# EAGLE design BusBlaster-v2.6 (EAGLE 5.10)
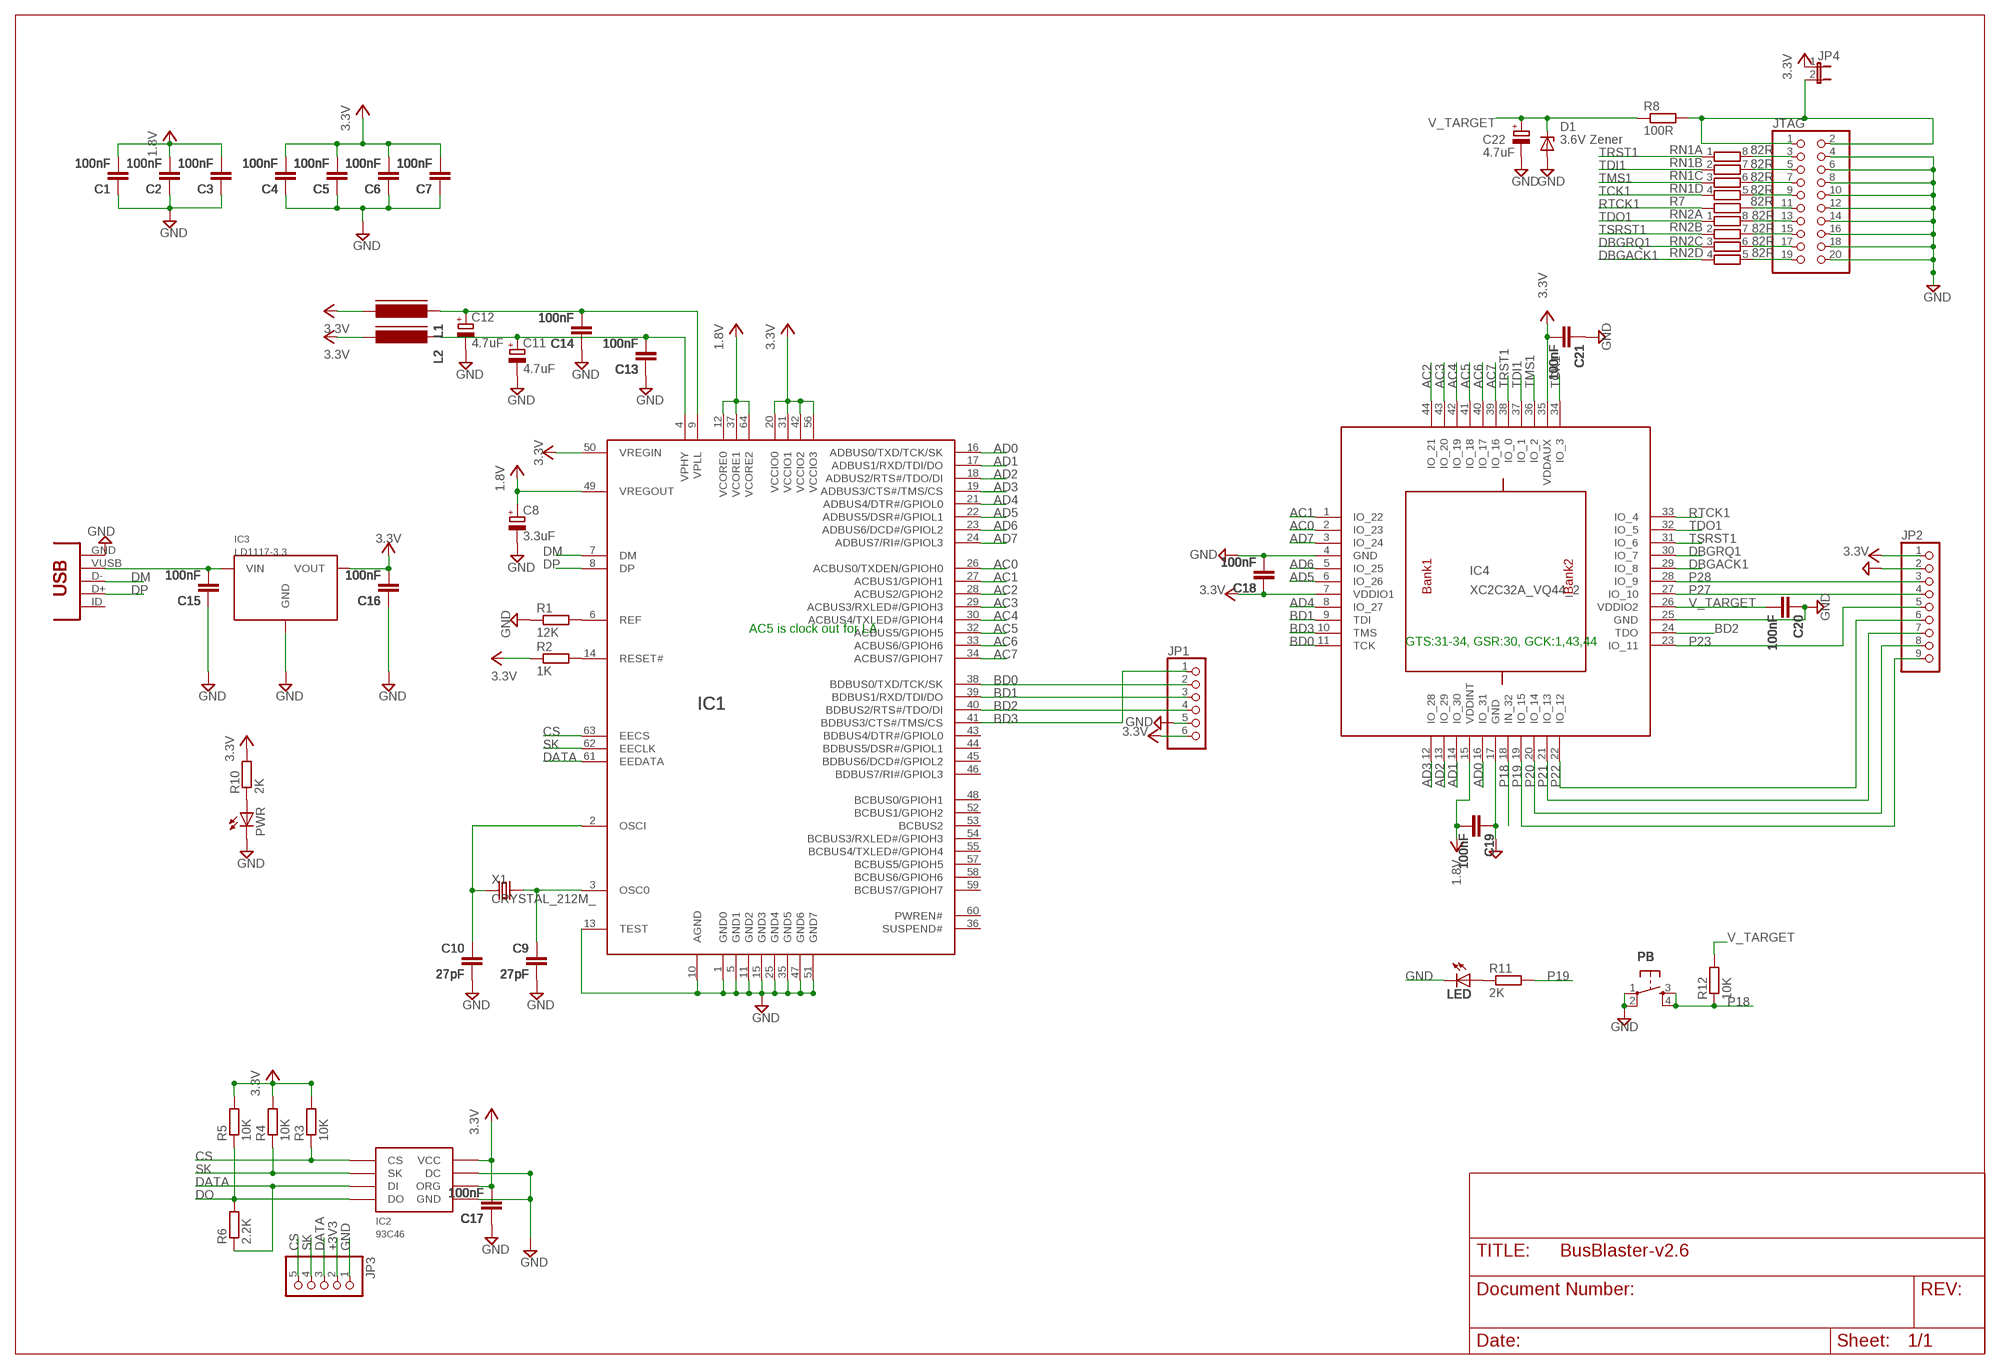
[diagram p0: schematic, sheet 1]

## Parts
C1  100nF  CAPC603  [C603]
C2  100nF  CAPC603  [C603]
C3  100nF  CAPC603  [C603]
C4  100nF  CAPC603  [C603]
C5  100nF  CAPC603  [C603]
C6  100nF  CAPC603  [C603]
C7  100nF  CAPC603  [C603]
C8  3.3uF  CAP_POLSMC_A  [SMC_A]
C9  27pF  CAPC603  [C603]
C10  27pF  CAPC603  [C603]
C11  4.7uF  CAP_POLSMC_A  [SMC_A]
C12  4.7uF  CAP_POLSMC_A  [SMC_A]
C13  100nF  CAPC603  [C603]
C14  100nF  CAPC603  [C603]
C15  100nF  CAPC603  [C603]
C16  100nF  CAPC603  [C603]
C17  100nF  CAPC603  [C603]
C18  100nF  CAPC603  [C603]
C19  100nF  CAPC603  [C603]
C20  100nF  CAPC603  [C603]
C21  100nF  CAPC603  [C603]
C22  4.7uF  CAP_POLSMC_A  [SMC_A]
D1  3.6V Zener  ZENERSOD-123  [SOD-123]
IC1  FT2232H  [LQFP64]
IC2  93C46  [SOIC8]
IC3  LD1117-3.3  [SOT223]
IC4  XC2C32A_VQ44_2  [VQ44]
JP1  PINHD-1X6  [1X06]
JP2  PINHD-1X9  [1X09]
JP3  PINHD-1X5  [1X05]
JP4  JP1EJP  [1X02]
JTAG  PINHEAD_-_COPY_PINHD-2X10SHROUDED  [PINHEAD_-_COPY_PINSHRD_PTH_2X10]
L1  FERRITE_BEAD603  [FB603]
L2  FERRITE_BEAD603  [FB603]
LED  LED805  [LED-805]
PB  SW-SMD-SMALL  [TACT_SWITCH_SMALL]
PWR  LEDCHIPLED_0805  [CHIPLED_0805]
R1  12K  RESISTORR603  [R603]
R2  1K  RESISTORR603  [R603]
R3  10K  RESISTORR603  [R603]
R4  10K  RESISTORR603  [R603]
R5  10K  RESISTORR603  [R603]
R6  2.2K  RESISTORR603  [R603]
R7  82R  RESISTORR603  [R603]
R8  100R  RESISTORR1206  [R1206]
R10  2K  RESISTORR603  [R603]
R11  2K  RESISTORR603  [R603]
R12  10K  RESISTORR603  [R603]
RN1  82R  RNETWORK  [RN8P-4R-CRA06S]
RN2  82R  RNETWORK  [RN8P-4R-CRA06S]
USB  CON-USB-MINI-BUSB1  [CONN_USB_MINI-B]
X1  CRYSTAL_212M_  [4X6]

## Nets
1.8V: C1.2 C2.2 C3.2 C8.+ C19.2 IC1.12(VCORE0) IC1.37(VCORE1) IC1.49(VREGOUT) IC1.64(VCORE2) IC4.15(VDDINT)
+3V3: C4.2 C5.2 C6.2 C7.2 C16.2 C17.2 C18.1 C21.2 IC1.20(VCCIO0) IC1.31(VCCIO1) IC1.42(VCCIO2) IC1.50(VREGIN) IC1.56(VCCIO3) IC2.6(ORG) IC2.8(VCC) IC3.2(VOUT) IC4.7(VDDIO1) IC4.35(VDDAUX) JP1.6 JP2.1 JP3.2 JP4.1 L1.2 L2.2 R2.1 R3.2 R4.2 R5.2 R10.2 ; supply symbol labelled 3.3V
AC0: IC1.26(ACBUS0/TXDEN/GPIOH0) IC4.2(IO_23)
AC1: IC1.27(ACBUS1/GPIOH1) IC4.1(IO_22)
AC2: IC1.28(ACBUS2/GPIOH2) IC4.44(IO_21)
AC3: IC1.29(ACBUS3/RXLED#/GPIOH3) IC4.43(IO_20)
AC4: IC1.30(ACBUS4/TXLED#/GPIOH4) IC4.42(IO_19)
AC5: IC1.32(ACBUS5/GPIOH5) IC4.41(IO_18)
AC6: IC1.33(ACBUS6/GPIOH6) IC4.40(IO_17)
AC7: IC1.34(ACBUS7/GPIOH7) IC4.39(IO_16)
AD0: IC1.16(ADBUS0/TXD/TCK/SK) IC4.16(IO_31)
AD1: IC1.17(ADBUS1/RXD/TDI/DO) IC4.14(IO_30)
AD2: IC1.18(ADBUS2/RTS#/TDO/DI) IC4.13(IO_29)
AD3: IC1.19(ADBUS3/CTS#/TMS/CS) IC4.12(IO_28)
AD4: IC1.21(ADBUS4/DTR#/GPIOL0) IC4.8(IO_27)
AD5: IC1.22(ADBUS5/DSR#/GPIOL1) IC4.6(IO_26)
AD6: IC1.23(ADBUS6/DCD#/GPIOL2) IC4.5(IO_25)
AD7: IC1.24(ADBUS7/RI#/GPIOL3) IC4.3(IO_24)
BD0: IC1.38(BDBUS0/TXD/TCK/SK) IC4.11(TCK) JP1.2
BD1: IC1.39(BDBUS1/RXD/TDI/DO) IC4.9(TDI) JP1.3
BD2: IC1.40(BDBUS2/RTS#/TDO/DI) IC4.24(TDO) JP1.4
BD3: IC1.41(BDBUS3/CTS#/TMS/CS) IC4.10(TMS) JP1.1
CS: IC1.63(EECS) IC2.1(CS) JP3.5 R3.1
DATA: IC1.61(EEDATA) IC2.3(DI) JP3.3 R6.1
DBGACK1: IC4.29(IO_8) RN2.4
DBGRQ1: IC4.30(IO_7) RN2.3
DM: IC1.7(DM) USB.D-
DO: IC2.4(DO) R5.1 R6.2
DP: IC1.8(DP) USB.D+
GND: C1.1 C2.1 C3.1 C4.1 C5.1 C6.1 C7.1 C8.- C9.2 C10.2 C11.- C12.- C13.1 C14.1 C15.1 C16.1 C17.1 C18.2 C19.1 C20.1 C21.1 C22.- D1.A IC1.1(GND0) IC1.5(GND1) IC1.10(AGND) IC1.11(GND2) IC1.13(TEST) IC1.15(GND3) IC1.25(GND4) IC1.35(GND5) IC1.47(GND6) IC1.51(GND7) IC2.5(GND) IC2.7(DC) IC3.1(GND) IC4.4(GND) IC4.17(GND) IC4.25(GND) JP1.5 JP2.2 JP3.1 JTAG.4 JTAG.6 JTAG.8 JTAG.10 JTAG.12 JTAG.14 JTAG.16 JTAG.18 JTAG.20 LED.C PB.1 PB.2 PWR.C R1.1 USB.GND
N$1: C9.1 IC1.3(OSC0) X1.2(X2)
N$2: C10.1 IC1.2(OSCI) X1.1(X1)
N$3: IC1.14(RESET#) R2.2
N$4: IC1.6(REF) R1.2
N$5: C15.2 IC3.3(VIN) USB.VUSB
N$6: PWR.A R10.1
N$7: JTAG.3 RN1.8
N$8: LED.A R11.1
N$9: JTAG.5 RN1.7
N$10: JTAG.7 RN1.6
N$11: JTAG.9 RN1.5
N$12: JTAG.11 R7.2
N$13: JTAG.13 RN2.8
N$14: JTAG.15 RN2.7
N$15: JTAG.17 RN2.6
N$16: JTAG.19 RN2.5
P18: IC4.18(IN_32) PB.3 PB.4 R12.1
P19: IC4.19(IO_15) JP2.9 R11.2
P20: IC4.20(IO_14) JP2.8
P21: IC4.21(IO_13) JP2.7
P22: IC4.22(IO_12) JP2.6
P23: IC4.23(IO_11) JP2.5
P27: IC4.27(IO_10) JP2.4
P28: IC4.28(IO_9) JP2.3
RTCK1: IC4.33(IO_4) R7.1
SK: IC1.62(EECLK) IC2.2(SK) JP3.4 R4.1
TCK1: IC4.34(IO_3) RN1.4
TDI1: IC4.37(IO_1) RN1.2
TDO1: IC4.32(IO_5) RN2.1
TMS1: IC4.36(IO_2) RN1.3
TRST1: IC4.38(IO_0) RN1.1
TSRST1: IC4.31(IO_6) RN2.2
V_TARGET: C20.2 C22.+ D1.C IC4.26(VDDIO2) R8.1 R12.2
V_TARGET_UNREG: JP4.2 JTAG.1 JTAG.2 R8.2
VPHY: C11.+ C13.2 IC1.4(VPHY) L2.1
VPLL: C12.+ C14.2 IC1.9(VPLL) L1.1
Unconnected: IC1.36(SUSPEND#) IC1.43(BDBUS4/DTR#/GPIOL0) IC1.44(BDBUS5/DSR#/GPIOL1) IC1.45(BDBUS6/DCD#/GPIOL2) IC1.46(BDBUS7/RI#/GPIOL3) IC1.48(BCBUS0/GPIOH1) IC1.52(BCBUS1/GPIOH2) IC1.53(BCBUS2) IC1.54(BCBUS3/RXLED#/GPIOH3) IC1.55(BCBUS4/TXLED#/GPIOH4) IC1.57(BCBUS5/GPIOH5) IC1.58(BCBUS6/GPIOH6) IC1.59(BCBUS7/GPIOH7) IC1.60(PWREN#) USB.BODY@1(BODY) USB.BODY@2(BODY) USB.BODY@3(BODY) USB.BODY@4(BODY) USB.ID(USBID)

## Notes on the sheet
- AC5 is clock out for LA
- GTS:31-34, GSR:30, GCK:1,43,44

## Library data of the parts
C1-C7 C9 C10 C13-C21 = dp_devices:CAP
C8 C11 C12 C22 = DP-EagleLibrary:CAP_POL
D1 = dp_devices:ZENER: Zener Diode SOD-323
IC1 = dp_devices:FT2232H: DUAL HIGH SPEED USB TO MULTIPURPOSE UART/FIFO IC
IC2 = DP-EagleLibrary:93C46
IC3 = DP-EagleLibrary:LD1117-3.3
IC4 = dp_devices:XC2C32A_VQ44_2: xc2c32a_vq44-ian edit this description Auto generated by make-symbol-device-package-bsdl.ulp Rev. 29 Source: xc2c32a_vq44-ian.bsd
JP1 = pinhead:PINHD-1X6: PIN HEADER
JP2 = pinhead - Copy:PINHD-1X9: PIN HEADER
JP3 = pinhead:PINHD-1X5: PIN HEADER
JP4 = jumper:JP1E: JUMPER
JTAG = LPC1768board:PINHEAD_-_COPY_PINHD-2X10: PIN HEADER
L1 L2 = dp_devices:FERRITE_BEAD
LED = dp_devices:LED
PB = dp_devices:SW-SMD-SMALL
PWR = led:LED: LED OSRAM: - CHIPLED LG R971, LG N971, LY N971, LG Q971, LY Q971, LO R971, LY R971 LH N974, LH R974 LS Q976, LO Q976, LY Q976 LO Q996 - Hyper CHIPLED LW Q18S LB Q993, LB Q99A, LB R99A - SideLED LS A670, LO A670, LY A670, LG A670, LP A670 LB A673, LV A673, LT A673, LW A673 LH A674 LY A675 LS A676, LA A676, LO A676, LY A676, LW A676 LS A679, LY A679, LG A679 - Hyper Micro SIDELED® LS Y876, LA Y876, LO Y876, LY Y876 LT Y87S - SmartLED LW L88C, LW L88S LB L89C, LB L89S, LG L890 LS L89K, LO L89K, LY L89K LS L896, LA L896, LO L896, LY L896 - TOPLED LS T670, LO T670, LY T670, LG T670, LP T670 LSG T670, LSP T670, LSY T670, LOP T670, LYG T670 LG T671, LOG T671, LSG T671 LB T673, LV T673, LT T673, LW T673 LH T674 LS T676, LA T676, LO T676, LY T676, LB T676, LH T676, LSB T676, LW T676 LB T67C, LV T67C, LT T67C, LS T67K, LO T67K, LY T67K, LW E67C LS E67B, LA E67B, LO E67B, LY E67B, LB E67C, LV E67C, LT E67C LW T67C LS T679, LY T679, LG T679 LS T770, LO T770, LY T770, LG T770, LP T770 LB T773, LV T773, LT T773, LW T773 LH T774 LS E675, LA E675, LY E675, LS T675 LS T776, LA T776, LO T776, LY T776, LB T776 LHGB T686 LT T68C, LB T68C - Hyper Mini TOPLED® LB M676 - Mini TOPLED Santana® LG M470 LS M47K, LO M47K, LY M47K Source: http://www.osram.convergy.de LUXEON: - LUMILED® LXK2-PW12-R00, LXK2-PW12-S00, LXK2-PW14-U00, LXK2-PW14-V00 LXK2-PM12-R00, LXK2-PM12-S00, LXK2-PM14-U00 LXK2-PE12-Q00, LXK2-PE12-R00, LXK2-PE12-S00, LXK2-PE14-T00, LXK2-PE14-U00 LXK2-PB12-K00, LXK2-PB12-L00, LXK2-PB12-M00, LXK2-PB14-N00, LXK2-PB14-P00, LXK2-PB14-Q00 LXK2-PR12-L00, LXK2-PR12-M00, LXK2-PR14-Q00, LXK2-PR14-R00 LXK2-PD12-Q00, LXK2-PD12-R00, LXK2-PD12-S00 LXK2-PH12-R00, LXK2-PH12-S00 LXK2-PL12-P00, LXK2-PL12-Q00, LXK2-PL12-R00 Source: www.luxeon.com KINGBRIGHT: KA-3528ASYC Source: www.kingbright.com
R1-R8 R10-R12 = dp_devices:RESISTOR
RN1 RN2 = dp_devices:RNETWORK: 4 Resistor Array 0603
USB = dp_devices:CON-USB-MINI-B: USB connector
X1 = dp_devices:CRYSTAL_2

## Board
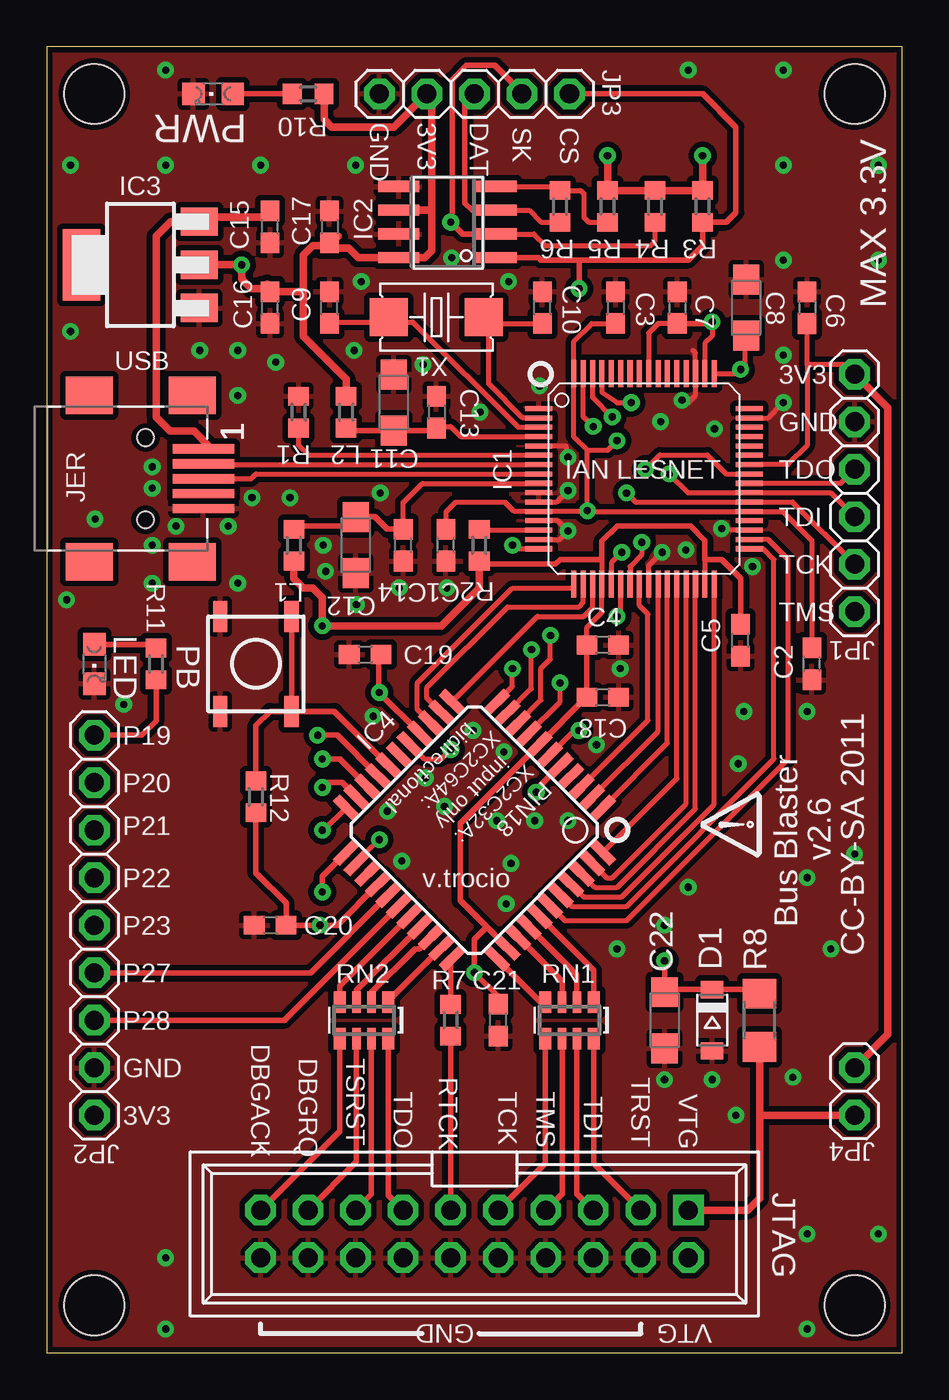
[diagram p1: board, top side]
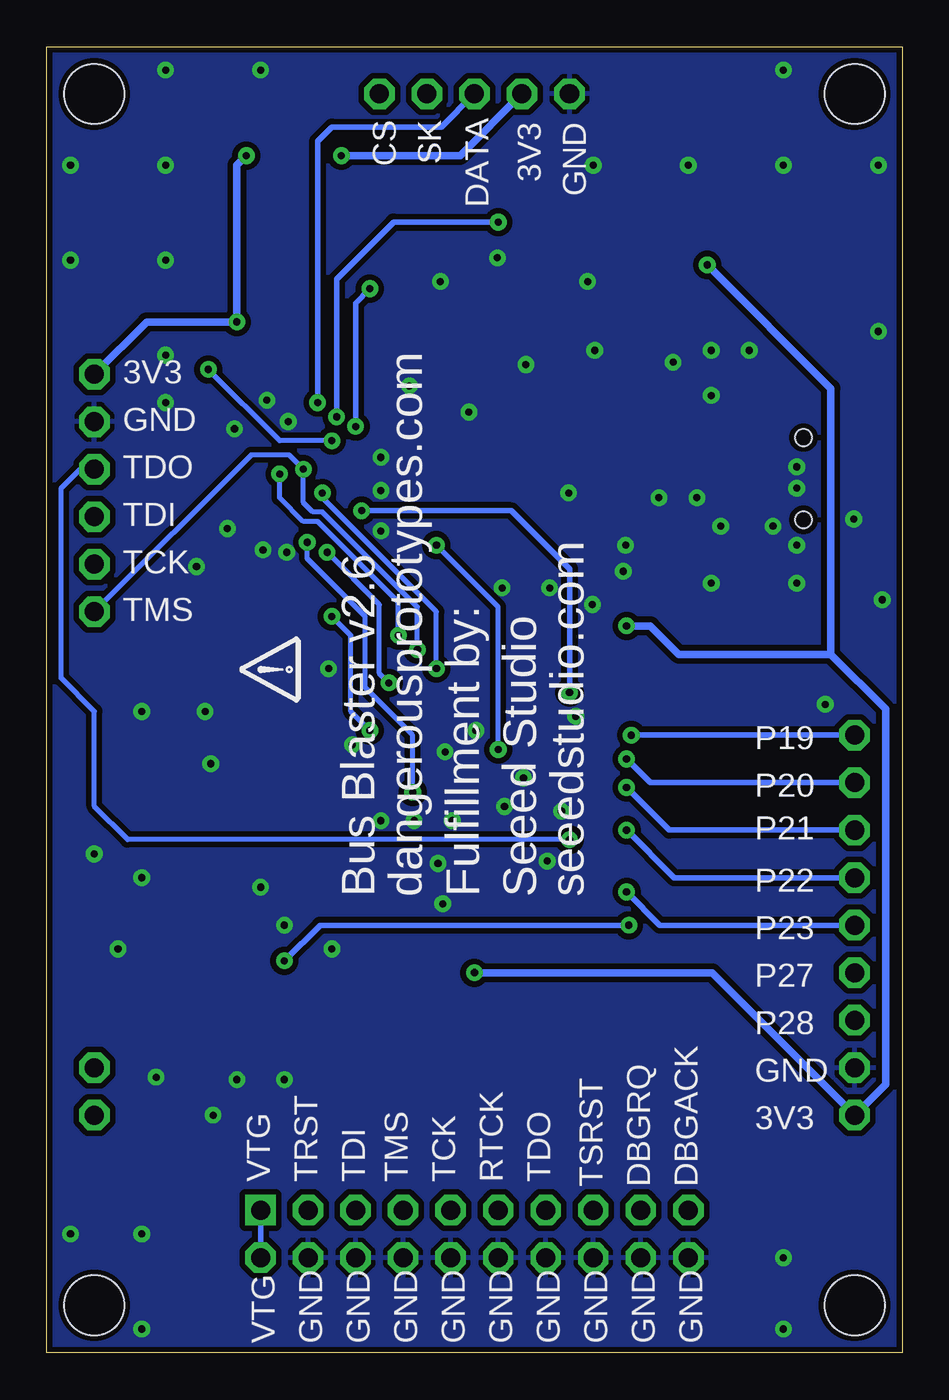
[diagram p2: board, bottom side, seen from below]

Size 45.72 x 69.83 mm. Coordinates in mm from the lower left corner, seen from the top.
Outline: 0,0 45.72,0 45.72,69.83 0,69.83 0,0
Copper layers (1*16): Top 0.035mm / dielectric 1.5mm / Bottom 0.035mm
Design rules "SparkFun": minimum track width 8mil, minimum drill 20mil, track to track 8mil, track to pad 8mil, pad to pad 8mil, via to via 8mil, smd to smd 8mil, copper to edge 10mil, drill to drill 8mil, minimum pad ring 12mil, minimum via ring 10mil, stop-mask expansion 4mil, vias tented up to drill 25mil, thermal gap 10mil
Holes 3.2 mm at 2.54,2.54 2.54,67.31 43.18,67.31 43.18,2.54

### Footprints (pad centres in the part's own frame; a part is rotated, then mirrored left to right if it is on the bottom)
C603 = smd 1.1 x 1: 1 -0.85,0; 2 0.85,0
SMC_A = smd 1.6 x 1.4: + -1.5,0; - 1.5,0
SOD-123 = smd 0.91 x 1.22: A 1.635,0; C -1.635,0
LQFP64 = smd 1.45 x 0.27: 1 -5.625,3.75; 2 -5.625,3.25; 3 -5.625,2.75; 4 -5.625,2.25; 5 -5.625,1.75; 6 -5.625,1.25; 7 -5.625,0.75; 8 -5.625,0.25; 9 -5.625,-0.25; 10 -5.625,-0.75; 11 -5.625,-1.25; 12 -5.625,-1.75; 13 -5.625,-2.25; 14 -5.625,-2.75; 15 -5.625,-3.25; 16 -5.625,-3.75; 33 5.625,-3.75; 34 5.625,-3.25; 35 5.625,-2.75; 36 5.625,-2.25; 37 5.625,-1.75; 38 5.625,-1.25; 39 5.625,-0.75; 40 5.625,-0.25; 41 5.625,0.25; 42 5.625,0.75; 43 5.625,1.25; 44 5.625,1.75; 45 5.625,2.25; 46 5.625,2.75; 47 5.625,3.25; 48 5.625,3.75 | smd 0.27 x 1.45: 17 -3.75,-5.625; 18 -3.25,-5.625; 19 -2.75,-5.625; 20 -2.25,-5.625; 21 -1.75,-5.625; 22 -1.25,-5.625; 23 -0.75,-5.625; 24 -0.25,-5.625; 25 0.25,-5.625; 26 0.75,-5.625; 27 1.25,-5.625; 28 1.75,-5.625; 29 2.25,-5.625; 30 2.75,-5.625; 31 3.25,-5.625; 32 3.75,-5.625; 49 3.75,5.625; 50 3.25,5.625; 51 2.75,5.625; 52 2.25,5.625; 53 1.75,5.625; 54 1.25,5.625; 55 0.75,5.625; 56 0.25,5.625; 57 -0.25,5.625; 58 -0.75,5.625; 59 -1.25,5.625; 60 -1.75,5.625; 61 -2.25,5.625; 62 -2.75,5.625; 63 -3.25,5.625; 64 -3.75,5.625
SOIC8 = smd 0.6 x 2.2: 1 -1.905,-2.6; 2 -0.635,-2.6; 3 0.635,-2.6; 4 1.905,-2.6; 5 1.905,2.6; 6 0.635,2.6; 7 -0.635,2.6; 8 -1.905,2.6
SOT223 = smd 1.5 x 2: 1 -2.3,-3.15; 2 0,-3.15; 3 2.3,-3.15 | smd 3.8 x 2: 4 0,3.15
VQ44 = smd 1.5 x 0.5: 1 -5.7,4; 2 -5.7,3.2; 3 -5.7,2.4; 4 -5.7,1.6; 5 -5.7,0.8; 6 -5.7,0; 7 -5.7,-0.8; 8 -5.7,-1.6; 9 -5.7,-2.4; 10 -5.7,-3.2; 11 -5.7,-4; 23 5.7,-4; 24 5.7,-3.2; 25 5.7,-2.4; 26 5.7,-1.6; 27 5.7,-0.8; 28 5.7,0; 29 5.7,0.8; 30 5.7,1.6; 31 5.7,2.4; 32 5.7,3.2; 33 5.7,4 | smd 0.5 x 1.5: 12 -4,-5.7; 13 -3.2,-5.7; 14 -2.4,-5.7; 15 -1.6,-5.7; 16 -0.8,-5.7; 17 0,-5.7; 18 0.8,-5.7; 19 1.6,-5.7; 20 2.4,-5.7; 21 3.2,-5.7; 22 4,-5.7; 34 4,5.7; 35 3.2,5.7; 36 2.4,5.7; 37 1.6,5.7; 38 0.8,5.7; 39 0,5.7; 40 -0.8,5.7; 41 -1.6,5.7; 42 -2.4,5.7; 43 -3.2,5.7; 44 -4,5.7
1X06 = drill 1.016 octagon: 1 -6.35,0; 2 -3.81,0; 3 -1.27,0; 4 1.27,0; 5 3.81,0; 6 6.35,0
1X09 = drill 1.016 octagon: 1 -10.16,0; 2 -7.62,0; 3 -5.08,0; 4 -2.54,0; 5 0,0; 6 2.54,0; 7 5.08,0; 8 7.62,0; 9 10.16,0
1X05 = drill 1.016 octagon: 1 -5.08,0; 2 -2.54,0; 3 0,0; 4 2.54,0; 5 5.08,0
1X02 = drill 1.016 octagon: 1 -1.27,0; 2 1.27,0
PINHEAD_-_COPY_PINSHRD_PTH_2X10 = drill 1.016 square: 1 -11.43,-1.27 | drill 1.016 octagon: 2 -11.43,1.27; 3 -8.89,-1.27; 4 -8.89,1.27; 5 -6.35,-1.27; 6 -6.35,1.27; 7 -3.81,-1.27; 8 -3.81,1.27; 9 -1.27,-1.27; 10 -1.27,1.27; 11 1.27,-1.27; 12 1.27,1.27; 13 3.81,-1.27; 14 3.81,1.27; 15 6.35,-1.27; 16 6.35,1.27; 17 8.89,-1.27; 18 8.89,1.27; 19 11.43,-1.27; 20 11.43,1.27
FB603 = smd 1 x 1.1: 1 -0.85,0; 2 0.85,0
LED-805 = smd 1.2 x 1.2: A 0,-1.05; C 0,1.05
TACT_SWITCH_SMALL = smd 1.651 x 0.762: 1 -2.54,1.905; 2 2.54,1.905; 3 -2.54,-1.905; 4 2.54,-1.905
CHIPLED_0805 = smd 1.2 x 1.2: A 0,-1.05; C 0,1.05
R603 = smd 1 x 1.1: 1 -0.85,0; 2 0.85,0
R1206 = smd 1.6 x 1.803: 1 -1.422,0; 2 1.422,0
RN8P-4R-CRA06S = smd 0.63 x 1.15: 1 -1.295,-0.975; 4 1.295,-0.975; 5 1.295,0.975; 8 -1.295,0.975 | smd 0.44 x 1.15: 2 -0.4,-0.975; 3 0.4,-0.975; 6 0.4,0.975; 7 -0.4,0.975
CONN_USB_MINI-B = smd 2 x 2.5: BODY@1 -4.45,2.5; BODY@2 4.45,2.5; BODY@3 4.45,-3; BODY@4 -4.45,-3 | smd 0.5 x 3.3: D+ 0,3.1; D- -0.8,3.1; GND 1.6,3.1; ID 0.8,3.1; VUSB -1.6,3.1 | hole 0.9: -2.2,0; 2.2,0
4X6@1 = smd 2.032 x 2.032: 1 -2.54,0; 2 2.54,0

### Placement (x,y rotation side)
C1  21.34,43.18 90 top
C2  40.89,36.83 90 top
C3  30.4,55.88 270 top
C4  29.72,37.84 180 top
C5  37.08,38.1 90 top
C6  40.64,55.88 270 top
C7  33.7,55.88 270 top
C8  37.38,55.88 90 top
C9  15.11,55.88 90 top
C10  26.5,55.88 90 top
C11  18.54,50.8 90 top
C12  16.51,43.18 270 top
C13  20.83,50.29 270 top
C14  19.05,43.18 90 top
C15  11.94,60.2 90 top
C16  11.94,55.88 90 top
C17  15.11,60.2 270 top
C18  29.72,35.05 0 top
C19  17.02,37.34 0 top
C20  11.94,22.86 0 top
C21  24.13,17.78 90 top
C22  33.02,17.78 270 top
D1  35.56,17.78 270 top
IC1  31.92,46.74 0 top
IC2  21.42,60.45 90 top
IC3  5,58.17 90 top
IC4  22.86,27.94 225 top
JP1  43.18,45.97 90 top
JP2  2.54,22.86 90 top
JP3  22.86,67.31 0 top
JP4  43.18,13.97 270 top
JTAG  22.86,6.35 180 top
L1  13.21,43.18 270 top
L2  16,50.29 90 top
LED  2.54,36.83 180 top
PB  11.18,36.83 90 top
PWR  8.89,67.31 90 top
R1  13.46,50.29 270 top
R2  23.11,43.18 90 top
R3  35.05,61.29 90 top
R4  32.51,61.29 90 top
R5  29.97,61.29 90 top
R6  27.43,61.29 90 top
R7  21.59,17.78 270 top
R8  38.1,17.78 270 top
R10  13.97,67.31 0 top
R11  5.84,36.83 270 top
R12  11.18,29.72 270 top
RN1  27.94,17.78 180 top
RN2  16.95,17.78 180 top
U$1  [DP_LOGO]  37.59,28.24 90 top
U$3  [DP_LOGO]  32.77,36.53 90 bottom
USB  5.27,46.74 270 top
X1  CRYSTAL_212M_  [4X6@1]  20.83,55.37 180 top

### Tracks (layer width: path | path; a pad name or v marks a point on that pad's centre or on a via)
1.8V  (via drill 0.38)
  Top 0.254: 28.88,48.26 28.17,48.96 IC1.64 28.17,54.08 29.12,55.03 C3.2 | 28.88,44.99 28.88,48.26 | C8.+ 37.34,54.33 37.34,52.83 v37.08,52.58 36.84,52.34 35.7,52.34 IC1.49 | C1.2 21.34,44.96 21.84,45.47 24.51,45.47 24.99,44.99 IC1.12 28.93,44.99 | C2.2 40.89,43.43 39.34,44.99 IC1.37 28.93,44.99 | v28.89,45.02 28.93,44.99 | 28.88,48.26 29.97,48.26 v30.48,48.77
  Top 0.305: C19.2 17.76,37.08 17.76,35.31 | 17.76,35.31 IC4.15 | 17.76,35.31 v17.78,35.31 | 28.88,44.99 28.88,45.01 v28.89,45.02
  Bottom 0.254: v37.08,52.58 33.27,48.77 v30.48,48.77
  Bottom 0.305: v17.78,35.31 17.78,41.91 20.89,45.02 v28.89,45.02
+3V3  (via drill 0.38)
  Top 0.254: C7.2 32.68,55.03 32.17,54.53 IC1.56 | C4.2 28.87,38.77 29.67,39.58 IC1.20 29.67,42.42 | R2.1 23.02,42.42 | v35.56,55.12 35.56,54.36 35.17,53.97 IC1.50 | IC1.42 39.61,47.49 40.64,48.51 40.64,52.83 | 35.17,42.42 IC1.31 | 40.64,52.83 C6.2 | JP1.6 42.67,52.83 40.64,52.83
  Top 0.305: C4.2 C18.1 28.84,35.05 IC4.7 22.1,28.31 22.1,24.18 23.52,22.76 | C5.2 37.08,41.41 36.07,42.42 35.17,42.42 35.17,43.44 34.42,44.2 30.48,44.2 29.67,43.39 29.67,42.42 27.43,42.42 27.18,42.16 22.86,42.16 | 23.52,22.76 IC4.35 | C7.2 35.47,55.03 v35.56,55.12 | 23.52,22.76 22.86,22.1 v22.86,20.32 24.13,19.05 C21.2 | 23.11,42.42 22.86,42.16 | 23.11,42.42 23.11,42.67 | 23.02,42.42 23.02,42.07 | 23.02,42.07 22.86,42.16 | 23.11,42.42 R2.1 23.11,42.16 23.02,42.07
  Top 0.406: C17.2 15.58,59.69 | C17.2 14.95,59.05 16.13,59.05 16.64,58.55 IC2.8 20.19,58.55 20.57,58.93 20.57,61.09 | 8.66,58.14 IC3.2 v10.41,58.17 10.41,57.4 10.92,56.9 12.03,56.9 | 12.03,56.9 11.78,57.15 | L2.2 16,52.07 13.72,54.36 13.72,56.9 | 13.72,56.9 13.72,58.67 14.22,59.18 15.2,59.18 C17.2 | 13.72,56.9 13.71,56.73 C16.2 12.03,56.9 | 20.57,61.09 IC2.6 | v29.97,64.01 R5.2 R4.2 R3.2 v35.05,64.01 | 20.57,61.09 20.57,67.06 JP3.2 18.54,65.53 15.24,65.53 14.82,65.95 R10.2 | JP1.6 44.96,50.55 44.96,17.02 JP4.1 | R2.1 23.11,40.89 21.08,38.86 v14.73,38.86 14.73,40.39 14.22,40.89 13.72,40.89 13.21,41.4 L1.2
  Bottom 0.406: v35.05,64.01 35.56,63.5 v35.56,55.12 40.39,55.12 JP1.6 | v29.97,64.01 23.62,64.01 JP3.2 | 3.81,37.34 0.89,34.42 0.89,14.35 JP2.1 10.16,20.32 v22.86,20.32 | 3.81,37.34 3.81,51.56 v10.41,58.17 | 3.81,37.34 11.94,37.34 13.46,38.86 v14.73,38.86
AC0
  Top 0.254: IC4.2 32.67,33.23 IC1.26
AC1
  Top 0.254: IC4.1 33.17,32.6 IC1.27
AC2
  Top 0.254: IC4.44 33.67,30.69 IC1.28
AC3
  Top 0.254: IC4.43 29.93,25.4 30.23,25.4 34.17,29.35 IC1.29
AC4
  Top 0.254: IC4.42 29.3,24.89 30.48,24.89 34.67,29.09 IC1.30
AC5
  Top 0.254: IC4.41 28.68,24.38 30.73,24.38 35.67,29.32 IC1.32
AC6
  Top 0.254: IC4.40 28.05,23.88 30.99,23.88 38.86,31.75 38.86,42.42 38.29,42.99 IC1.33
AC7
  Top 0.254: IC4.39 27.69,23.11 30.99,23.11 39.62,31.75 39.62,42.42 38.56,43.49 IC1.34
AD0  (via drill 0.38)
  Top 0.254: v24.89,43.18 25.09,42.99 IC1.16 | v21.59,32.26 21.08,31.75 20.18,31.75 IC4.16
  Bottom 0.254: v24.89,43.18 21.59,39.88 v21.59,32.26
AD1
  Top 0.254: IC4.14 19.81,34.38 19.81,35.81 24.88,40.88 28.15,40.88 IC1.17
AD2
  Top 0.254: IC4.13 20.32,35.01 20.32,35.56 24.64,39.88 28.45,39.88 28.67,40.1 IC1.18
AD3
  Top 0.254: IC4.12 26.23,39.37 28.7,39.37 29.17,39.84 IC1.19
AD4  (via drill 0.38)
  Top 0.254: IC4.8 25.76,33.12 27.43,34.8 v27.43,35.81 | IC1.21 30.17,42.24 v30.73,42.8
  Bottom 0.254: v30.73,42.8 27.94,40.01 27.94,36.32 v27.43,35.81
AD5  (via drill 0.38)
  Top 0.254: v28.45,33.27 28.19,33.27 IC4.6 | IC1.22 30.67,39.56 v30.48,39.37
  Bottom 0.254: v28.45,33.27 29.46,34.29 29.46,38.35 v30.48,39.37
AD6  (via drill 0.38)
  Top 0.254: IC1.23 31.17,42.05 31.8,42.67 v31.8,43.33
  Top 0.305: IC4.5 26.16,30.11 v26.16,29.97
  Bottom 0.254: v31.8,43.33 31.8,42.47 28.7,39.37 28.7,35.56 26.16,33.02 v26.16,29.97
AD7
  Top 0.254: IC4.3 32.13,33.82 32.13,39.5 31.67,39.95 IC1.24
BD0  (via drill 0.38)
  Top 0.254: IC4.11 24.89,35.63 v24.89,36.58 | v30.99,45.97 31.48,45.49 IC1.38 39.86,45.49 JP1.2
  Bottom 0.254: v24.89,36.58 24.89,39.62 30.99,45.72 v30.99,45.97
BD1  (via drill 0.38)
  Top 0.254: JP1.3 41.9,45.99 IC1.39 34.28,45.99 v33.27,46.99 | v26.92,38.35 26.92,37.08 26.42,36.58 26.42,34.89 IC4.9
  Bottom 0.254: v33.27,46.99 33.27,45.72 32,44.45 31.24,44.45 26.92,40.13 v26.92,38.35
BD2  (via drill 0.38 pad 0.38)
  Top 0.254: JP1.4 42.42,46.49 IC1.40 | IC4.24 16.57,26.22 v17.78,27.43
  Bottom 0.254: v17.78,27.43 41.4,27.43 43.18,29.21 43.18,34.29 44.96,36.07 44.96,46.23 43.94,47.24 JP1.4
BD3  (via drill 0.38)
  Top 0.254: IC4.10 25.91,35.51 v25.91,37.59 | v32,47.24 32.77,48.01 35.31,48.01 36.33,46.99 IC1.41
  Bottom 0.254: v25.91,37.59 25.91,39.88 30.99,44.96 31.5,44.96 32,45.47 v32,47.24 32.77,48.01 34.8,48.01 JP1.1
CS  (via drill 0.38)
  Top 0.254: v29.21,49.53 28.67,50.07 IC1.63
  Top 0.305: IC2.1 26.29,58.55 26.42,58.42 28.45,58.42 | 28.45,58.42 34.29,58.42 35.05,59.18 R3.1 35.06,60.45 36.32,60.45 36.83,60.96 36.83,65.53 35.05,67.31 JP3.5 | v28.45,56.9 28.45,58.42
  Bottom 0.305: v29.21,49.53 29.21,56.13 v28.45,56.9
DATA  (via drill 0.38)
  Top 0.254: IC2.3 25.78,61.09 26.42,60.45 27.42,60.45 R6.1 | v31.24,50.8 30.48,50.8 29.67,51.35 IC1.61
  Top 0.305: JP3.3 22.35,66.8 22.35,61.47 22.73,61.09 IC2.3
  Bottom 0.305: v31.24,50.8 31.24,64.77 30.48,65.53 24.64,65.53 JP3.3
DBGACK1
  Top 0.305: IC4.29 15.66,19.61 RN2.4
DBGRQ1
  Top 0.305: IC4.30 16.55,19.37 RN2.3
DM
  Top 0.254: 8.89,47.49 8.24,47.49 | USB.D- 8.84,47.54 8.89,47.49 | 8.89,47.49 IC1.7
DO
  Top 0.254: IC2.4 27.05,62.36 27.18,62.48 27.09,62.48 R6.2 28.53,62.14 28.7,61.98 28.7,60.71 28.96,60.45 29.96,60.45 R5.1
DP
  Top 0.254: USB.D+ 10.92,46.74 11.17,46.99 IC1.8
GND  (via drill 0.38)
  Top 0.254: IC1.5 27.76,48.49 v27.86,47.88 | 34.54,53.59 34.67,53.46 IC1.51 34.67,51.18 34.29,50.8 34.08,50.8 v33.96,50.93 | IC1.35 36.15,43.99 v36.07,44.07 | IC1.15 27.4,43.49 v27.86,43.94 27.32,44.49 IC1.13 | IC1.11 27.25,45.49 v27.86,46.1 | IC1.25 32.17,42.08 v32.89,42.8 | IC1.47 38.56,49.99 v39.37,50.8
  other vias: 20.11,52.83 10.97,45.72 9.7,44.2 37.26,34.29 29.38,32.51 30.65,36.58 5.63,46.23 14.78,43.18 14.91,41.78 18.84,40.89 21.38,40.89 16.56,40.01 24.05,28.45 27.86,28.45 18.21,28.96 20.24,30.73 22.78,33.27 17.45,34.04 26.08,28.45 33.02,22.86 30.48,21.59 34.29,24.89 39.37,68.58 39.37,63.5 39.37,58.42 44.45,58.42 44.45,63.5 34.29,68.58 6.35,68.58 1.27,63.5 6.35,63.5 11.43,63.5 16.51,63.5 1.27,54.61 6.35,1.27 6.35,5.08 40.64,1.27 41.91,21.59 40.64,25.4 36.83,12.7 18.97,26.29 24.81,26.16 24.56,24 24.43,32.13 21.26,29.21 39.37,53.34 35.69,49.4 37.72,42.04 36.96,31.5 34.16,42.93 32.81,49.78 26.34,51.69 16.43,53.59 16.81,57.28 24.68,57.28 21.64,58.55 23.16,50.29 12.24,52.96 8.18,53.59 10.21,51.18 5.63,47.37 2.59,44.58 10.21,41.15 1.06,40.26 10.21,53.59 13,45.72 17.83,45.97 5.63,43.18 6.91,44.2 43.18,26.67 40.64,34.29 44.45,6.35 40.64,6.35 39.88,14.73 5.63,41.15 4.11,34.67 33.02,14.61 35.56,14.61
  pour Bottom (isolate 0.305): 0,69.83 0,0 45.72,0 45.72,69.83
  pour Top (isolate 0.305): 0,69.83 0,0 45.72,0 45.72,69.83
N$1
  Top 0.254: C9.1 15.37,55.24 15.24,55.12 18.03,55.12 X1.2 | X1.2 18.29,55.63 18.54,55.37 | X1.2 18.54,55.12 19.56,55.12 25.19,49.49 IC1.3
N$2
  Top 0.254: 23.62,55.03 23.62,51.82 25.45,49.99 IC1.2 | 23.62,55.37 23.88,55.12 23.62,55.03 | 23.62,55.03 23.71,55.03 | 23.71,55.03 C10.1 | 23.71,55.03 X1.1
N$3
  Top 0.254: IC1.14 23.15,43.99 R2.2
N$4
  Top 0.254: R1.2 13.46,48.51 13.99,47.99 IC1.6
N$5
  Top 0.406: C15.2 12.19,60.71 8.9,60.71 IC3.3 6.62,60.47 5.84,59.69 5.84,50.04 6.6,49.28 7.87,49.28 8.69,48.46 USB.VUSB
N$6
  Top 0.305: PWR.A R10.1
N$7
  Top 0.305: JTAG.3 29.23,10.13 RN1.8
N$8
  Top 0.305: LED.A 5.64,37.88 R11.1
N$9
  Top 0.305: JTAG.5 28.34,8.49 RN1.7
N$10
  Top 0.305: JTAG.7 27.54,8.49 RN1.6
N$11
  Top 0.305: JTAG.9 26.64,10.13 RN1.5
N$12
  Top 0.305: JTAG.11 R7.2
N$13
  Top 0.305: JTAG.13 18.25,8.42 RN2.8
N$14
  Top 0.305: JTAG.15 17.36,8.46 RN2.7
N$15
  Top 0.305: JTAG.17 16.55,10.2 RN2.6
N$16
  Top 0.305: JTAG.19 15.66,11.85 RN2.5
P18
  Top 0.305: PB.3 PB.4 | PB.3 15.38,34.29 IC4.18 | R12.1 11.18,33.53 11.94,34.29 PB.3
P19  (via drill 0.38)
  Top 0.305: IC4.19 15.52,33.02 v14.48,33.02 | R11.2 5.84,33.78 5.08,33.02 JP2.9
  Bottom 0.305: JP2.9 v14.48,33.02
P20  (via drill 0.38)
  Top 0.305: IC4.20 15.66,31.75 v14.73,31.75
  Bottom 0.305: v14.73,31.75 13.46,30.48 JP2.8
P21  (via drill 0.38)
  Top 0.305: IC4.21 15.79,30.48 14.99,30.48 v14.73,30.23
  Bottom 0.305: v14.73,30.23 12.45,27.94 JP2.7
P22  (via drill 0.38)
  Top 0.305: IC4.22 14.8,27.94 v14.73,27.94
  Bottom 0.305: v14.73,27.94 12.19,25.4 JP2.6
P23  (via drill 0.38)
  Top 0.305: IC4.23 14.73,25.47 v14.73,24.64
  Bottom 0.305: v14.73,24.64 12.95,22.86 JP2.5
P27
  Top 0.305: JP2.4 14.11,20.32 IC4.27
P28
  Top 0.305: JP2.3 12.7,17.78 IC4.28
RTCK1
  Top 0.305: IC4.33 21.59,21.01 R7.1
SK  (via drill 0.38)
  Top 0.254: IC2.2 26.04,59.82 26.67,59.18 32.26,59.18 32.51,59.44 R4.1 | v30.23,50.04 29.17,51.09 IC1.62
  Top 0.305: JP3.4 25.4,67.39 23.95,68.83 22.43,68.83 21.67,68.07 21.67,60.53 v21.59,60.45 22.23,59.82 IC2.2
  Bottom 0.305: v30.23,50.04 30.23,57.4 27.18,60.45 v21.59,60.45
TCK1
  Top 0.305: IC4.34 26.39,18.75 RN1.4
TDI1
  Top 0.305: IC4.37 28.34,20.2 RN1.2
TDO1
  Top 0.305: IC4.32 18.25,18.8 RN2.1
TMS1
  Top 0.305: IC4.36 27.54,19.87 RN1.3
TRST1
  Top 0.305: IC4.38 29.23,20.43 RN1.1
TSRST1
  Top 0.305: RN2.2 17.36,19.26 19.68,21.59 19.9,21.59 IC4.31
V_TARGET  (via drill 0.38)
  Top 0.305: IC4.26 15.52,22.86 v14.61,22.86 C20.2 12.79,24.04 11.18,25.65 R12.2 | v33.02,20.95 33.02,19.43 | 33.02,19.43 C22.+ | 33.02,19.43 33.04,19.41 D1.C 35.58,19.43 38.1,19.43 R8.1
  Bottom 0.305: v33.02,20.95 31.11,22.86 v14.61,22.86
V_TARGET_UNREG
  Top 0.406: JTAG.1 37.47,7.62 38.1,8.26 38.1,12.7 | 38.1,12.7 R8.2 | 38.1,12.7 JP4.2
  Bottom 0.305: JTAG.2 JTAG.1
VPHY
  Top 0.254: C13.2 20.49,49.53 21.59,49.53 22.13,48.99 IC1.4
  Top 0.305: C13.2 20.74,49.44 20.6,49.3 C11.+ 16.23,49.3 15.84,49.44 L2.1
VPLL
  Top 0.254: C14.2 19.05,45.47 20.07,46.49 IC1.9
  Top 0.305: L1.1 13.04,44.03 13.46,44.2 16.03,44.2 C12.+ 16.23,44.7 17.53,44.7 18.2,44.03 C14.2

### Text on the board
tNames: GND | 3V3 | DAT | SK | CS | MAX 3.3V | 3V3 | GND | IAN LESNET | TDO | JER | TDI | TCK | TMS | P19 | P20 | P21 | v2.6 | P22 | v.trocio | Bus Blaster | P23 | CC-BY-SA 2011 | P27 | P28 | DBGACK | DBGRQ | TSRST | GND | RTCK | TRST | TDO | TCK | TMS | TDI | VTG | 3V3 | GND | VTG
bNames: GND | 3V3 | DATA | SK | CS | 3V3 | GND | TDO | TDI | TCK | TMS | P19 | P20 | P21 | P22 | seeedstudio.com | Seeed Studio | Fulfillment by: | dangerousprototypes.com | Bus Blaster v2.6 | P23 | P27 | P28 | GND | 3V3 | DBGACK | DBGRQ | TSRST | TDO | RTCK | TCK | TMS | TDI | TRST | VTG | GND | GND | GND | GND | GND | GND | GND | GND | GND | VTG